# EAGLE design pimpleface (EAGLE 9.5.1)
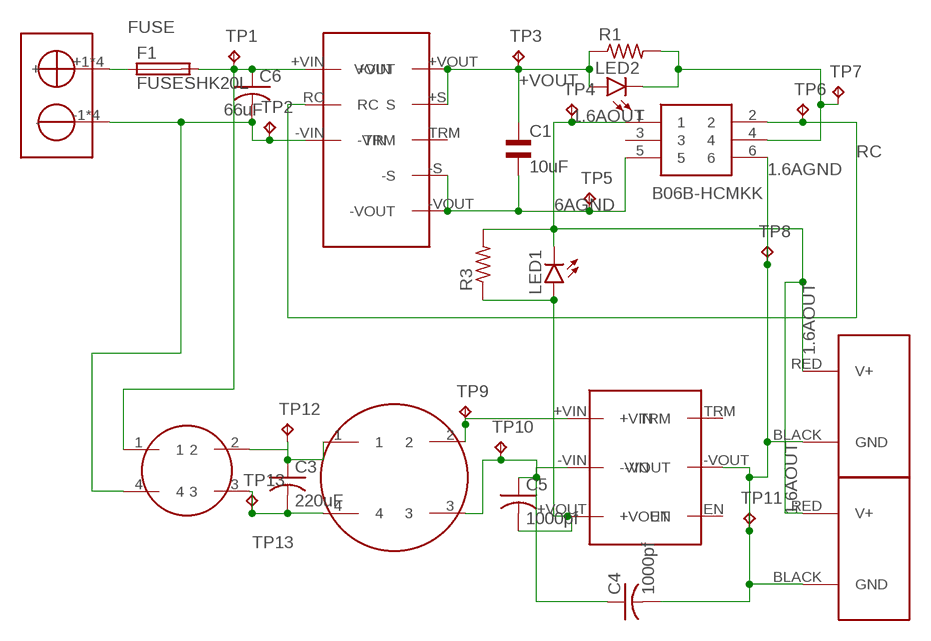
[diagram p0: schematic, sheet 1]

## Parts
BUCK150UH  CMNMODECHOKE150UH  [CMNMODECHOKE150UH]
C1  10uF  EL-BI25-10AXIAL  [EU25-10]
C3  220uF  C-USC0805  [C0805]
C4  1000pf  C-USC0805  [C0805]
C5  1000pf  C-USC0805  [C0805]
C6  66uF  C-USC0805  [C0805]
F1  FUSESHK20L  [SHK20L]
J1  B06B-HCMKK  [B06BHCMKK]
J2  POWERPOLE_POWER45A_DRILL  [POWERPOLE_PAIR_45A_HOLE]
J3  POWERPOLE_POWER45A_DRILL  [POWERPOLE_PAIR_45A_HOLE]
LED1  LEDCHIP-LED0603  [CHIP-LED0603]
LED2  LEDCHIP-LED0603  [CHIP-LED0603]
R1  R-US_R0805  [R0805]
R3  R-US_R0805  [R0805]
TP1  TPPAD1-13  [P1-13]
TP2  TPPAD1-13  [P1-13]
TP3  TPPAD1-13  [P1-13]
TP4  TPPAD1-13  [P1-13]
TP5  TPPAD1-13  [P1-13]
TP6  TPPAD1-13  [P1-13]
TP7  TPPAD1-13  [P1-13]
TP8  TPPAD1-13  [P1-13]
TP9  TPPAD1-13  [P1-13]
TP10  TPPAD1-13  [P1-13]
TP11  TPPAD1-13  [P1-13]
TP12  TPPAD1-13  [P1-13]
TP13  TPPAD1-13  [P1-13]
U$1  12V6ABUCKCONVERTER  [12V6ABUCKCONVERTER]
U$2  SB50  [MINI-SB-50]
U$3  BUCK1.6A  [BUCK1.6A]
U$4  CMNMODECHOKE1.2MH  [CMNMODECHOKE1.2MH]

## Nets
1.6AGND: C4.2 J1.6 J2.BLACK(GND) J3.BLACK(GND) TP8.TP TP11.TP U$3.-VOUT
1.6AOUT: J1.1 J2.RED(V+) J3.RED(V+) LED1.C R3.2 TP4.TP
6AGND: C1.2 J1.5 TP5.TP U$1.-S U$1.-VOUT
+VOUT: C1.1 LED2.A R1.1 TP3.TP U$1.+S(S) U$1.+VOUT(VOUT)
FUSE: F1.1A U$2.+1(+) U$2.+2(+) U$2.+3(+) U$2.+4(+)
LED: J1.4 LED2.C R1.2 TP7.TP
N$3: BUCK150UH.1 C6.1 F1.2A TP1.TP U$1.+VIN
N$7: C4.1 C5.1 TP10.TP U$3.-VIN U$4.3
N$9: C5.2 LED1.A R3.1 U$3.+VOUT
N$10: TP9.TP U$3.+VIN U$4.2
N$11: BUCK150UH.4 C6.2 TP2.TP U$1.-VIN U$2.-1(-) U$2.-2(-) U$2.-3(-) U$2.-4(-)
N$24: BUCK150UH.2 C3.1 TP12.TP U$4.1
RC: J1.2 TP6.TP U$1.RC
TP13: BUCK150UH.3 C3.2 TP13.TP U$4.4
Unconnected: J1.3 U$1.TRM U$3.EN U$3.TRM

## Library data of the parts
BUCK150UH = cmnModeChoke150uH:CMNMODECHOKE150UH
C1 = rcl:EL-: BIPOLAR ELECTROLYTIC CAPACITOR; SPICEPREFIX: C
C3-C6 = rcl:C-US: CAPACITOR, American symbol; SPICEPREFIX: C
F1 = fuse:FUSE: Fuse; OC_FARNELL: unknown; OC_NEWARK: unknown
J1 = B06B-HCMKK:B06B-HCMKK: Automotive Connectors 6P AIT Header Top Position (BLK) Source: Datasheet <https://componentsearchengine.com/Datasheets/1/B06B-HCMKK.pdf>; DESCRIPTION: Automotive Connectors 6P AIT Header Top Position (BLK); HEIGHT: 13.7mm; MANUFACTURER_NAME: JST (JAPAN SOLDERLESS TERMINALS); MANUFACTURER_PART_NUMBER: B06B-HCMKK; MOUSER_PART_NUMBER: 306-B06B-HCMKK; MOUSER_PRICE-STOCK: https://www.mouser.com/Search/Refine.aspx?Keyword=306-B06B-HCMKK
J2 J3 = powerpoles:POWERPOLE_POWER: Anderson Powerpole Power Connector using ameteur radio standard layout
LED1 LED2 = led:LED: LED OSRAM: - CHIPLED LG R971, LG N971, LY N971, LG Q971, LY Q971, LO R971, LY R971 LH N974, LH R974 LS Q976, LO Q976, LY Q976 LO Q996 - Hyper CHIPLED LW Q18S LB Q993, LB Q99A, LB R99A - SideLED LS A670, LO A670, LY A670, LG A670, LP A670 LB A673, LV A673, LT A673, LW A673 LH A674 LY A675 LS A676, LA A676, LO A676, LY A676, LW A676 LS A679, LY A679, LG A679 - Hyper Micro SIDELED® LS Y876, LA Y876, LO Y876, LY Y876 LT Y87S - SmartLED LW L88C, LW L88S LB L89C, LB L89S, LG L890 LS L89K, LO L89K, LY L89K LS L896, LA L896, LO L896, LY L896 - TOPLED LS T670, LO T670, LY T670, LG T670, LP T670 LSG T670, LSP T670, LSY T670, LOP T670, LYG T670 LG T671, LOG T671, LSG T671 LB T673, LV T673, LT T673, LW T673 LH T674 LS T676, LA T676, LO T676, LY T676, LB T676, LH T676, LSB T676, LW T676 LB T67C, LV T67C, LT T67C, LS T67K, LO T67K, LY T67K, LW E67C LS E67B, LA E67B, LO E67B, LY E67B, LB E67C, LV E67C, LT E67C LW T67C LS T679, LY T679, LG T679 LS T770, LO T770, LY T770, LG T770, LP T770 LB T773, LV T773, LT T773, LW T773 LH T774 LS E675, LA E675, LY E675, LS T675 LS T776, LA T776, LO T776, LY T776, LB T776 LHGB T686 LT T68C, LB T68C - Hyper Mini TOPLED® LB M676 - Mini TOPLED Santana® LG M470 LS M47K, LO M47K, LY M47K Source: http://www.osram.convergy.de LUXEON: - LUMILED® LXK2-PW12-R00, LXK2-PW12-S00, LXK2-PW14-U00, LXK2-PW14-V00 LXK2-PM12-R00, LXK2-PM12-S00, LXK2-PM14-U00 LXK2-PE12-Q00, LXK2-PE12-R00, LXK2-PE12-S00, LXK2-PE14-T00, LXK2-PE14-U00 LXK2-PB12-K00, LXK2-PB12-L00, LXK2-PB12-M00, LXK2-PB14-N00, LXK2-PB14-P00, LXK2-PB14-Q00 LXK2-PR12-L00, LXK2-PR12-M00, LXK2-PR14-Q00, LXK2-PR14-R00 LXK2-PD12-Q00, LXK2-PD12-R00, LXK2-PD12-S00 LXK2-PH12-R00, LXK2-PH12-S00 LXK2-PL12-P00, LXK2-PL12-Q00, LXK2-PL12-R00 Source: www.luxeon.com KINGBRIGHT: KA-3528ASYC Source: www.kingbright.com
R1 R3 = rcl:R-US_: RESISTOR, American symbol; SPICEPREFIX: R
TP1-TP13 = testpad:TP: Test pad
U$1 = 12v6aBuckConverter:12V6ABUCKCONVERTER
U$2 = REV BLDC:SB50
U$3 = buck_1.6:BUCK1.6A
U$4 = cmnModeChoke1.2mH:CMNMODECHOKE1.2MH

## Board
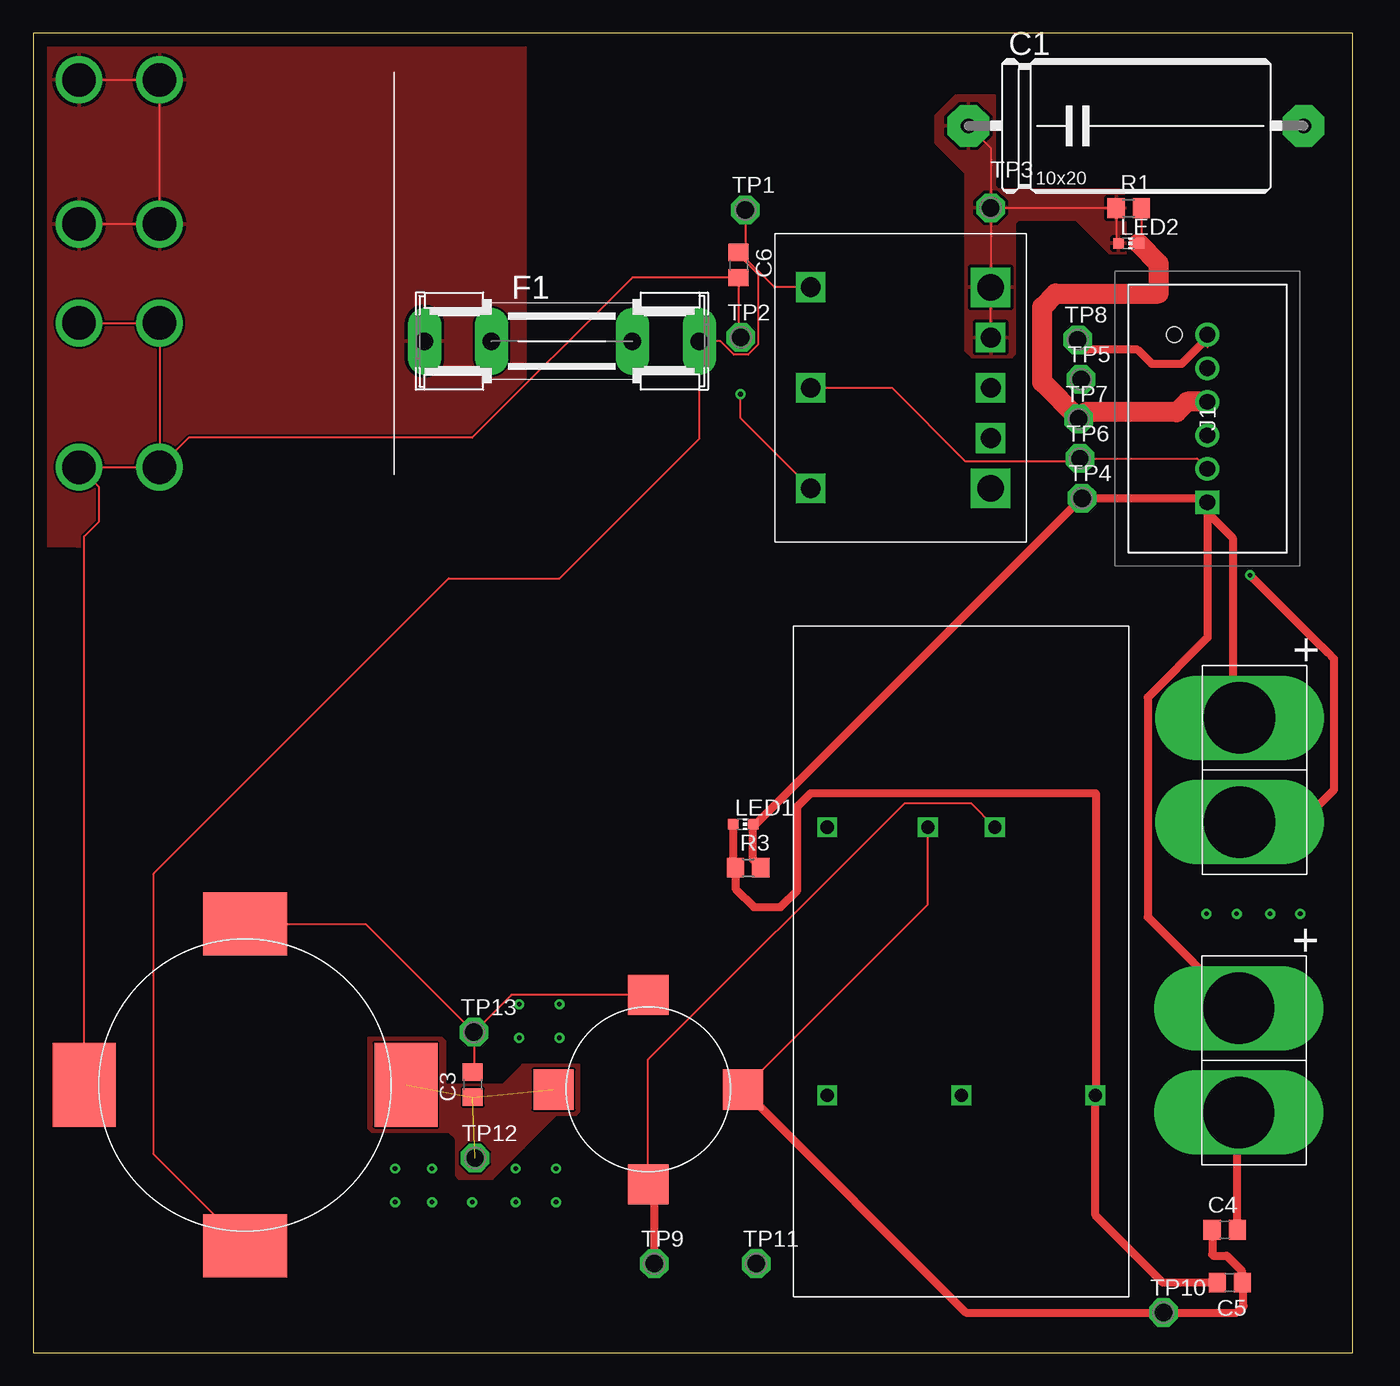
[diagram p1: board, top side]
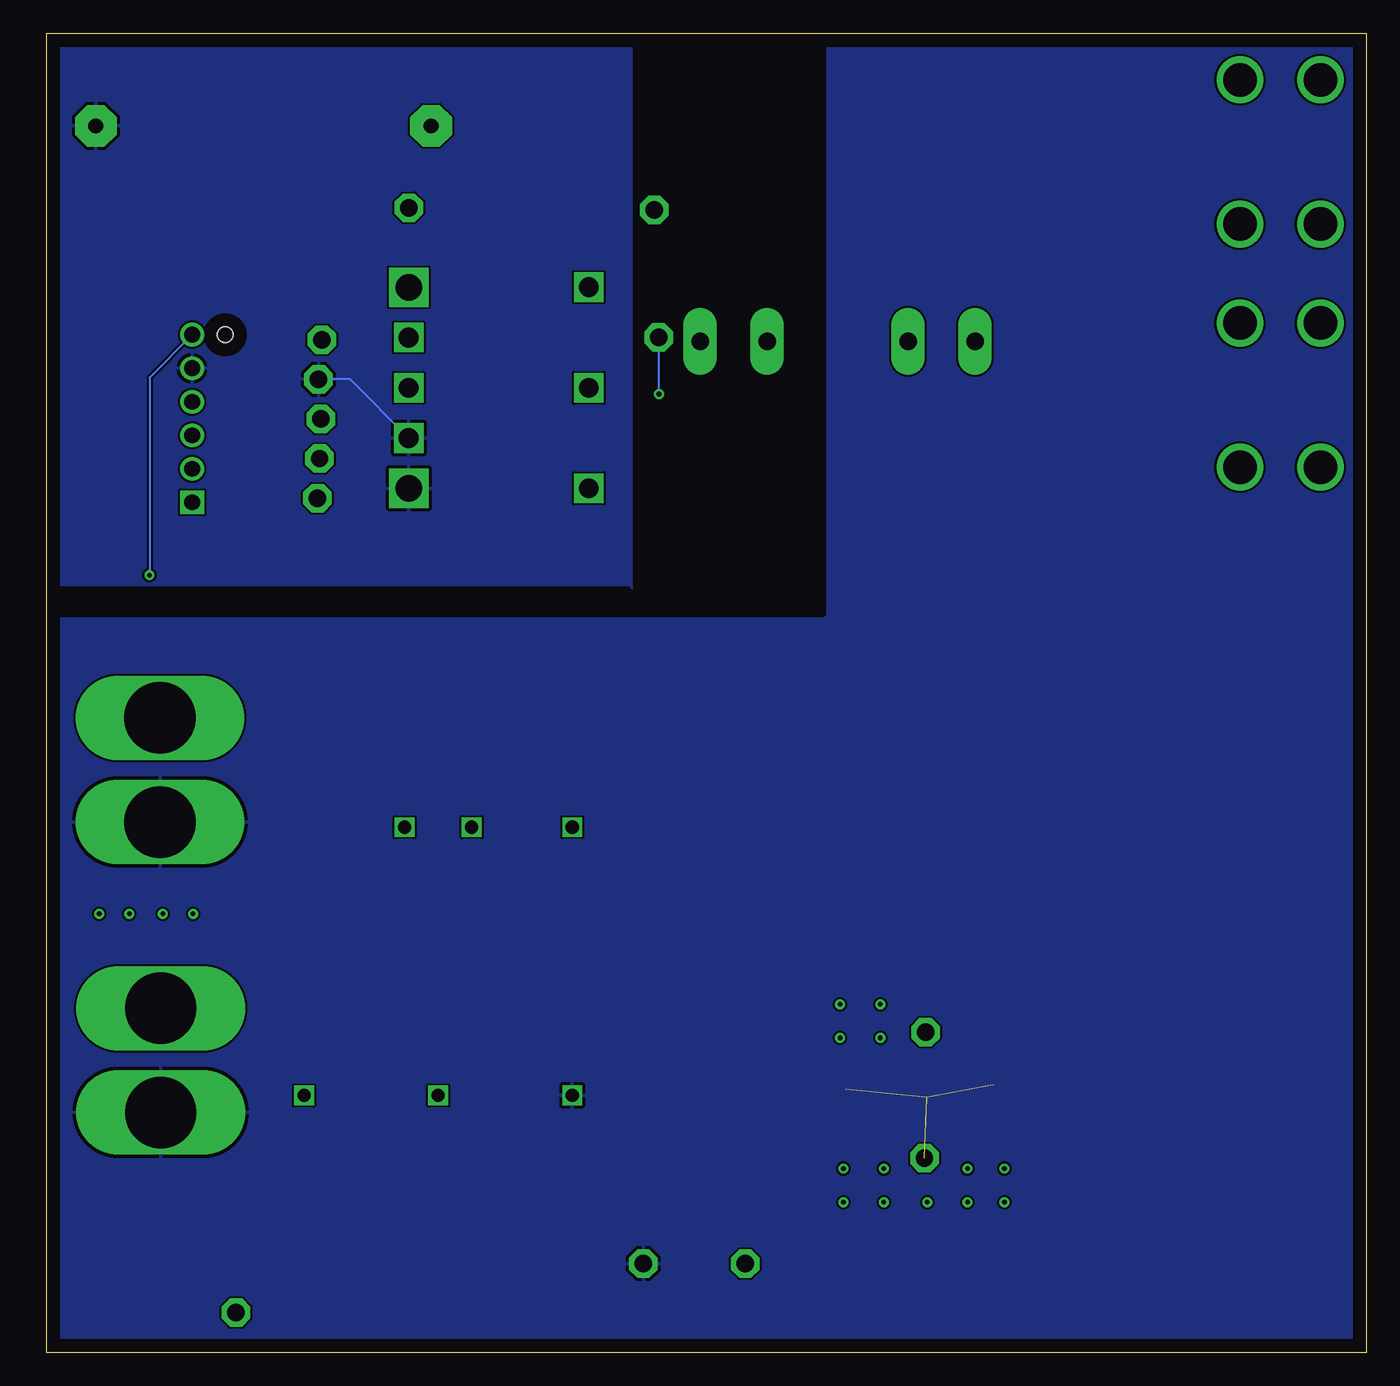
[diagram p2: board, bottom side, seen from below]

Size 100 x 100 mm. Coordinates in mm from the lower left corner, seen from the top.
Outline: 0,0 100,0 100,100 0,100 0,0
Copper layers (1*16): Top 0.035mm / dielectric 1.5mm / Bottom 0.035mm
Design rules "default": minimum track width 6mil, minimum drill 0.35mm, track to track 6mil, track to pad 6mil, pad to pad 6mil, via to via 6mil, smd to smd 6mil, copper to edge 40mil, drill to drill 6mil, minimum pad ring 10mil, minimum via ring 8mil, stop-mask expansion 4mil, vias tented up to drill 0mil, thermal gap 10mil

### Footprints (pad centres in the part's own frame; a part is rotated, then mirrored left to right if it is on the bottom)
CMNMODECHOKE150UH = smd 4.763 x 6.35: 1 -12.192,0; 3 12.192,0 | smd 6.35 x 4.763: 2 0,-12.192; 4 0,12.192
EU25-10 = drill 1.118 pad 3.15 octagon: 1 -12.7,0; 2 12.7,0
C0805 = smd 1.3 x 1.5: 1 -0.95,0; 2 0.95,0
SHK20L = drill 1.321 pad 2.54 long: 1A -10.414,0; 1B -5.334,0; 2A 10.414,0; 2B 5.334,0
B06BHCMKK = drill 1.2 pad 1.8 square: 1 0,0 | drill 1.2 pad 1.8: 2 2.54,0; 3 5.08,0; 4 7.62,0; 5 10.16,0; 6 12.7,0 | hole 1.2: 12.7,2.5
POWERPOLE_PAIR_45A_HOLE = drill 5.4 long: BLACK 3.95,-1.15; RED -3.95,-1.15
CHIP-LED0603 = smd 0.8 x 0.8: A 0,-0.75; C 0,0.75
R0805 = smd 1.3 x 1.5: 1 -0.95,0; 2 0.95,0
P1-13 = drill 1.321 pad 2.159 octagon: TP 0,0
12V6ABUCKCONVERTER = drill 1.5 square: +S 6.82,3.81; +VIN -6.82,7.62; -S 6.82,-3.81; -VIN -6.82,-7.62; RC -6.82,0; TRM 6.82,0 | drill 2 square: +VOUT 6.82,7.62; -VOUT 6.82,-7.62
MINI-SB-50 = drill 2.54: +1 -6.096,14.668; +2 0,14.668; +3 -6.096,3.747; +4 0,3.747; -1 -6.096,-3.747; -2 0,-3.747; -3 -6.096,-14.668; -4 0,-14.668
BUCK1.6A = drill 1 square: +VIN 2.54,10.16; +VOUT 10.16,-10.16; -VIN -2.54,10.16; -VOUT -10.16,-10.16; EN -10.16,10.16; TRM 0,-10.16
CMNMODECHOKE1.2MH = smd 3.048 x 3.048: 1 0,7.176; 2 -7.176,0; 3 0,-7.176; 4 7.176,0

### Placement (x,y rotation side)
BUCK150UH  16.06,20.31 90 top
C1  83.57,92.96 0 top
C3  33.31,20.33 90 top
C4  90.28,9.33 0 top
C5  90.66,5.33 180 top
C6  53.45,82.43 270 top
F1  40.07,76.65 0 top
J1  88.97,64.44 90 top
J2  92.55,44.17 270 top
J3  92.5,22.17 270 top
LED1  53.8,40.06 270 top
LED2  82.99,84.06 270 top
R1  83.01,86.73 0 top
R3  54.18,36.76 0 top
TP1  53.96,86.6 0 top
TP2  53.63,76.94 0 top
TP3  72.55,86.76 0 top
TP4  79.47,64.76 0 top
TP5  79.39,73.76 0 top
TP6  79.31,67.76 0 top
TP7  79.23,70.76 0 top
TP8  79.15,76.76 0 top
TP9  47.07,6.76 0 top
TP10  85.64,3.06 0 top
TP11  54.79,6.76 0 top
TP12  33.49,14.76 0 top
TP13  33.41,24.3 0 top
U$1  65.74,73.12 0 top
U$2  9.58,81.78 0 top
U$3  70.33,29.67 0 top
U$4  46.61,19.96 90 top

### Tracks (layer width: path | path; a pad name or v marks a point on that pad's centre or on a via)
1.6AGND  (via drill 0.35)
  Top 0.152: 88.97,76.89 J1.6 88.97,76.2 | 91.23,18.1 J3.BLACK
  Top 0.61: TP8.TP 79.91,76 83.69,76 84.75,74.94 87.02,74.94 88.97,76.89 | C4.2 91.23,18.1 | v92.2,58.93 97.03,54.1 98.04,53.09 98.55,52.58 98.55,42.67 96.1,40.22 J2.BLACK
  Bottom 0.152: J1.6 92.2,73.91 v92.2,58.93 92.2,58.67
  pour Bottom: 101.09,55.88 101.09,-0.25 100.58,-0.76 -2.54,-0.76 -4.32,1.02 -4.32,103.38 -3.05,104.65 40.89,104.65 40.89,55.88 41.15,55.63 100.84,55.63
1.6AOUT
  Top 0.152: 88.65,64.76 J1.1 88.97,63.68 | 54.77,40.06 LED1.C | R3.2 54.55,37.34
  Top 0.61: 88.65,64.76 TP4.TP 54.77,40.06 | 54.55,37.34 LED1.C | J1.1 88.97,54.19 84.45,49.67 84.45,33.02 J3.RED | 88.97,63.68 90.89,61.76 90.89,48.63 J2.RED
6AGND
  Bottom 0.152: U$1.-S 77.01,73.76 TP5.TP
  pour Bottom: 100.84,58.17 55.88,58.17 55.63,57.91 55.63,102.11 101.85,102.11 102.11,102.36 102.11,59.44
+VOUT
  Top 0.152: TP3.TP 72.58,86.73 R1.1 82.06,84.24 LED2.A | TP3.TP U$1.+VOUT U$1.+S | C1.1 72.55,91.28 TP3.TP
  pour Top: 68.33,93.22 68.33,91.69 70.61,89.41 70.61,75.95 71.12,75.44 74.17,75.44 74.42,75.69 74.42,85.6 74.68,85.85 78.99,85.85 81.53,83.31 82.8,83.31 82.8,87.63 82.55,87.88 82.3,88.14 73.15,88.14 72.9,88.39 72.9,95.25 69.85,95.25 68.33,93.73
FUSE
  Top 0.152: U$2.+1 U$2.+2 U$2.+4 U$2.+3
  pour Top: -3.56,106.17 -3.56,61.21 37.34,60.52 37.34,105.92 37.59,106.17
LED
  Top 0.152: R1.2 83.96,84.28 LED2.C
  Top 1.524: J1.4 87.45,72.06 86.65,71.27 79.74,71.27 TP7.TP 76.45,73.54 76.45,79.25 77.47,80.26 85.26,80.26 85.26,82.54 LED2.C
N$2  (via drill 0.35)
  other vias: 96.01,33.27
N$3
  Top 0.152: BUCK150UH.1 9.14,15.03 9.14,36.32 31.5,58.67 39.88,58.67 50.48,69.28 F1.2A 52.07,76.65 53.09,75.63 54.17,75.63 54.94,76.39 54.94,81.71 53.45,83.2 C6.1 53.49,83.42 | TP1.TP 53.96,83.89 53.49,83.42 | U$1.+VIN 56.17,80.74 53.49,83.42
N$4  (via drill 0.35)
  other vias: 93.73,33.27
N$5  (via drill 0.35)
  other vias: 91.19,33.27
N$6  (via drill 0.35)
  other vias: 88.9,33.27
N$7
  Top 0.152: C5.1 91.31,5.03 | 91.69,5.25 C5.1 | 89.33,7.44 89.41,7.37 | 91.61,6.18 C5.1 | U$4.3 67.79,33.97 U$3.-VIN
  Top 0.61: U$4.3 70.69,3.06 TP10.TP 91.2,3.06 91.69,3.56 91.69,5.25 | C4.1 89.33,7.44 | 89.41,7.37 90.42,7.37 91.61,6.18
N$8  (via drill 0.35)
  other vias: 27.43,13.97
N$9
  Top 0.152: R3.1 53.05,36.94 | 80.52,19.54 U$3.+VOUT
  Top 0.61: 53.05,36.94 LED1.A | C5.2 85.6,5.33 80.49,10.44 U$3.+VOUT | R3.1 53.23,35.16 54.61,33.78 56.64,33.78 57.91,35.05 57.91,39.62 57.91,41.4 58.93,42.42 80.52,42.42 80.52,19.54
N$10
  Top 0.152: 47.07,12.32 U$4.2 46.61,22.23 66.04,41.66 71.04,41.66 U$3.+VIN
  Top 0.61: TP9.TP 47.07,12.32
N$11  (via drill 0.35)
  Top 0.152: U$2.-1 U$2.-2 U$2.-4 | U$2.-4 U$2.-3 5,65.6 5,63 3.87,61.87 BUCK150UH.4 | TP2.TP 53.45,77.11 C6.2 45.41,81.48 33.27,69.34 11.81,69.34 U$2.-4 | U$1.-VIN 53.59,70.83 v53.59,72.64
  Bottom 0.152: v53.59,72.64 53.59,76.9 TP2.TP
N$12  (via drill 0.35)
  other vias: 30.23,13.97
N$13  (via drill 0.35)
  other vias: 27.43,11.43
N$14  (via drill 0.35)
  other vias: 30.23,11.43
N$15  (via drill 0.35)
  other vias: 33.27,11.43
N$16  (via drill 0.35)
  other vias: 36.58,11.43
N$17  (via drill 0.35)
  other vias: 39.62,11.43
N$18  (via drill 0.35)
  other vias: 39.62,13.97
N$19  (via drill 0.35)
  other vias: 36.58,13.97
N$20  (via drill 0.35)
  other vias: 39.88,23.88
N$21  (via drill 0.35)
  other vias: 36.83,23.88
N$22  (via drill 0.35)
  other vias: 36.83,26.42
N$23  (via drill 0.35)
  other vias: 39.88,26.42
N$24  (3 unrouted)
RC
  Top 0.152: U$1.RC 65.06,73.12 70.61,67.56 79.11,67.56 TP6.TP 88.19,67.76 J1.2
TP13
  Top 0.152: TP13.TP 25.21,32.5 BUCK150UH.3 | TP13.TP 33.41,21.38 C3.2 | U$4.4 36.25,27.14 TP13.TP
TP-12
  pour Top (no thermals): 41.4,21.84 37.08,21.84 35.56,20.32 31.24,20.32 31.24,23.62 30.99,23.88 25.4,23.88 25.4,17.02 25.65,16.76 31.5,16.76 32,16.26 32,13.46 32.26,13.21 34.8,13.21 39.62,18.03 39.88,18.03 41.15,18.03 41.4,18.29